# Altium project planespotter.PrjPCB
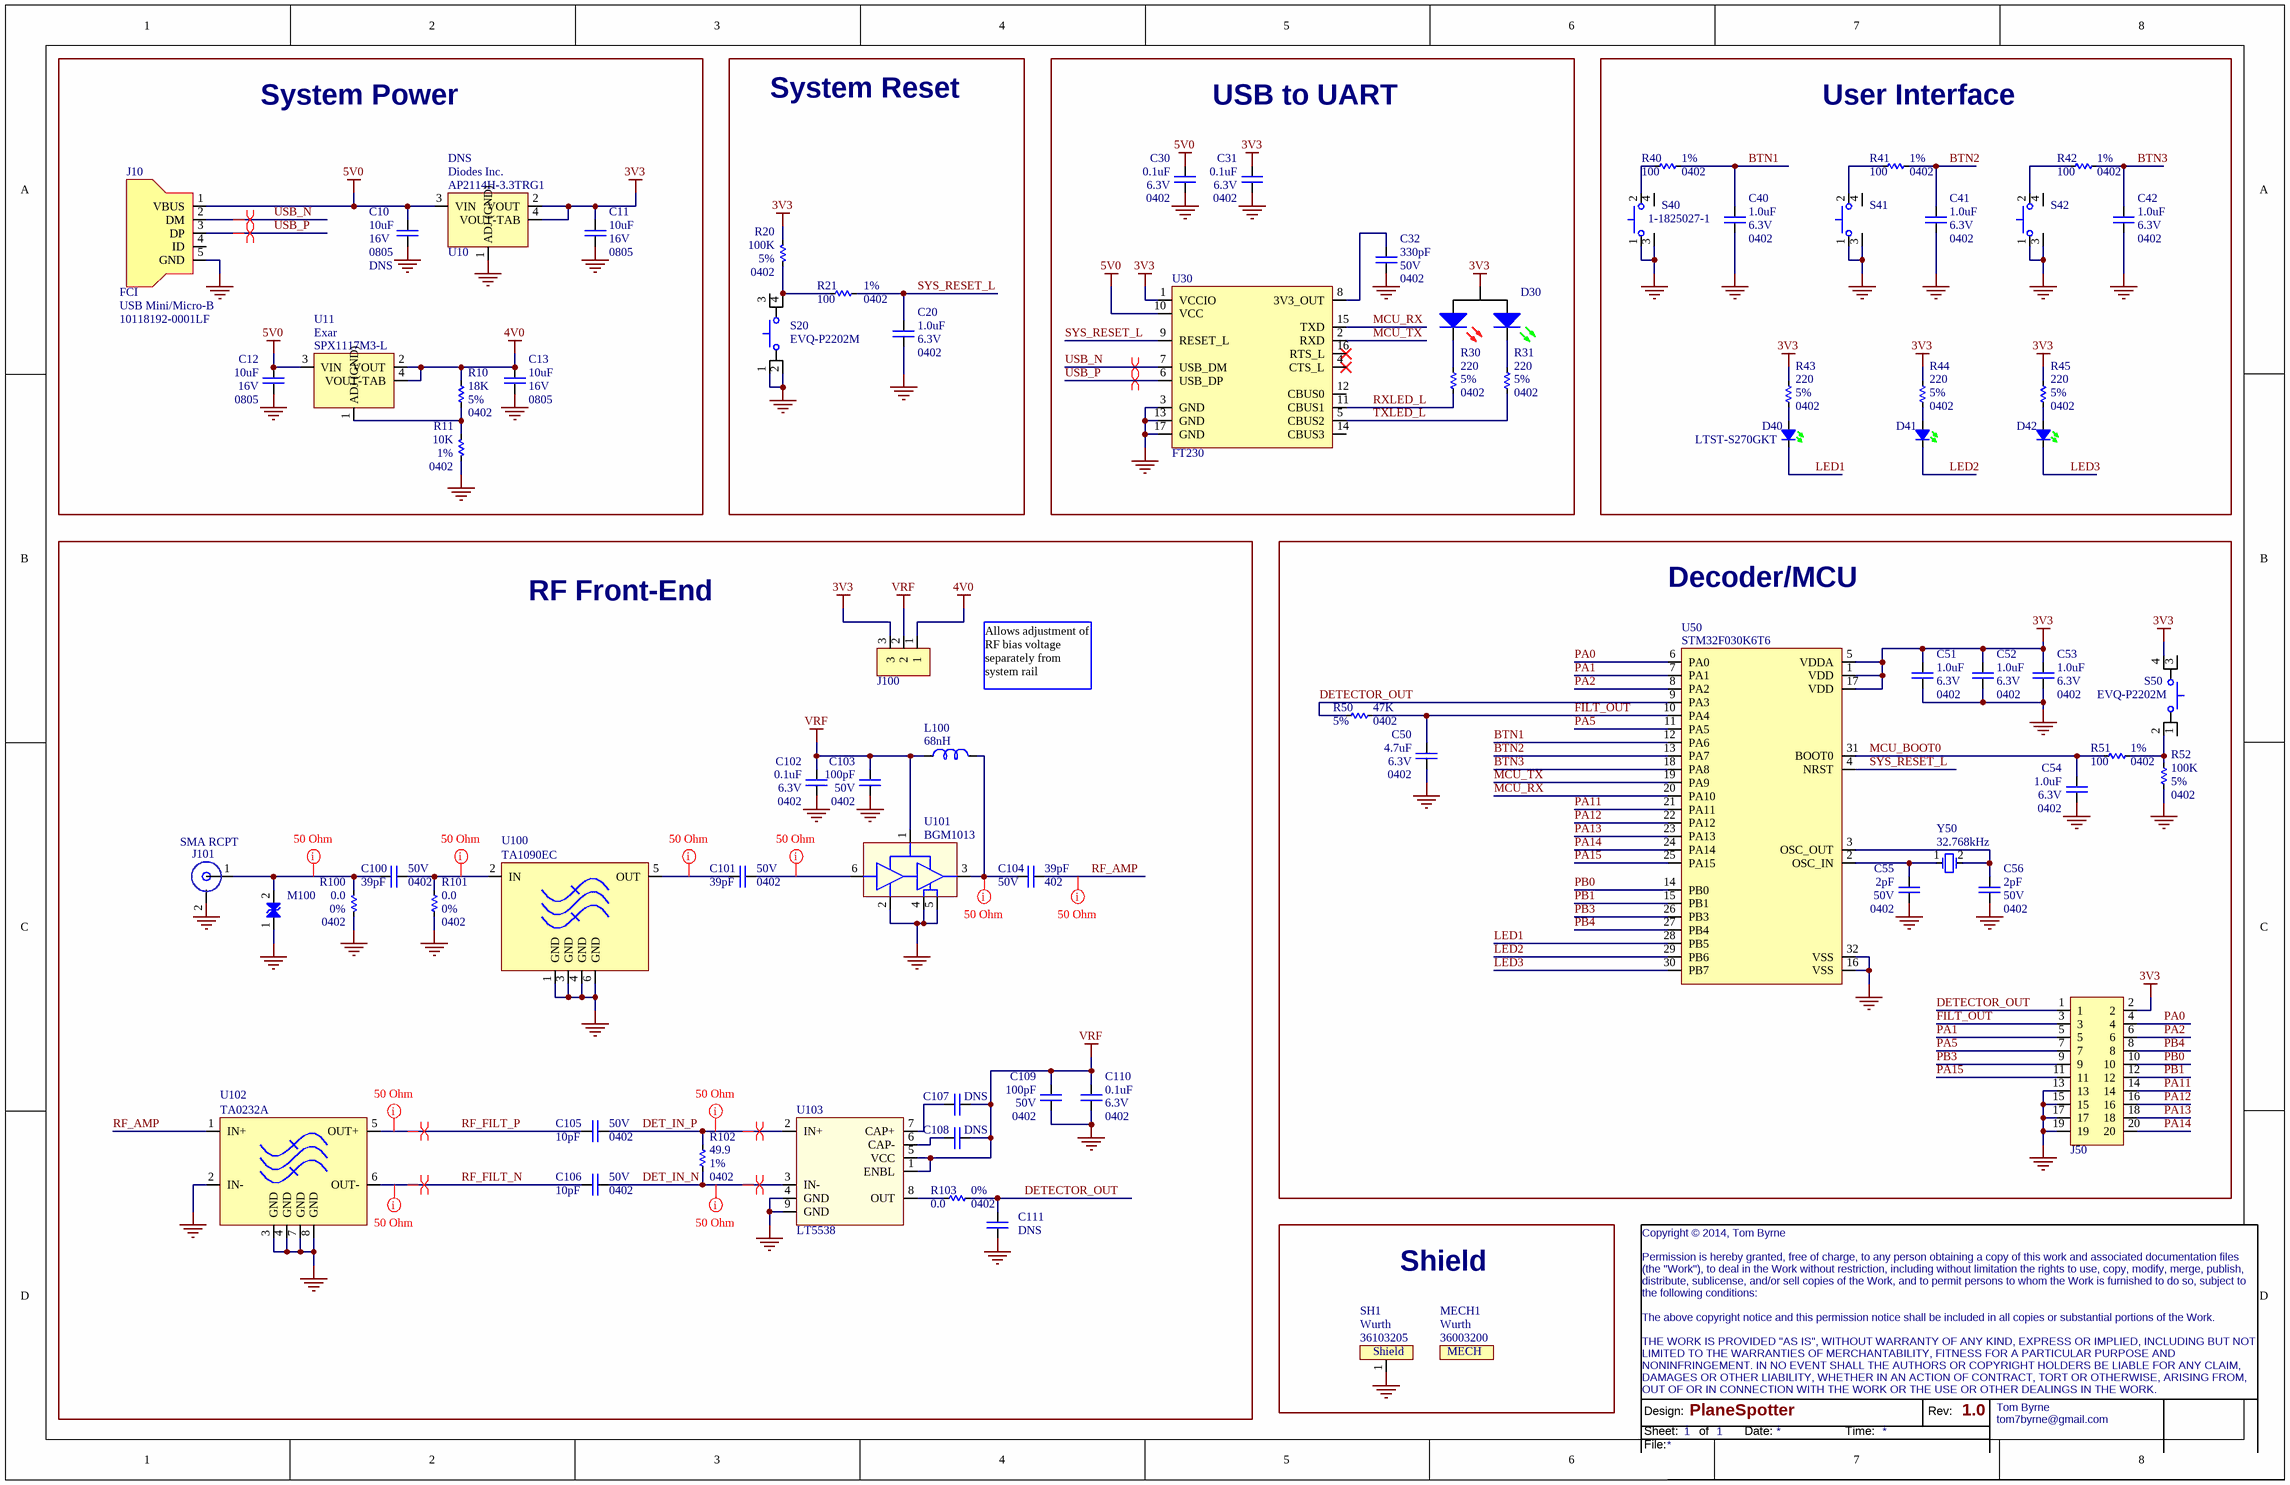
[diagram p0: planespotter.SchDoc]
1 sheet, 75 parts. Net scope: global (net labels, ports and power ports of the same name join across sheets).
Board file: planespotter.PcbDoc

## Sheet planespotter.SchDoc: PlaneSpotter
size Tabloid; Revision: 1.0; SheetNumber: 1; SheetTotal: 1; ProjectName: PlaneSpotter

### Parts
C10  value 10uF  Voltage: 16V  Package: 0805  BOMOPTION: DNS  [CAPC2012X14N]  (hidden comment: Ceramic Capacitor)  (no BOM)
C11  value 10uF  Voltage: 16V  Package: 0805  [CAPC2012X14N]  (hidden comment: Ceramic Capacitor)
C12  value 10uF  Voltage: 16V  Package: 0805  [CAPC2012X14N]  (hidden comment: Ceramic Capacitor)
C13  value 10uF  Voltage: 16V  Package: 0805  [CAPC2012X14N]  (hidden comment: Ceramic Capacitor)
C20  value 1.0uF  Voltage: 6.3V  Package: 0402  [CAPC1005X07N]  (hidden comment: Ceramic Capacitor)
C30  value 0.1uF  Voltage: 6.3V  Package: 0402  [CAPC1005X07N]  (hidden comment: Ceramic Capacitor)
C31  value 0.1uF  Voltage: 6.3V  Package: 0402  [CAPC1005X07N]  (hidden comment: Ceramic Capacitor)
C32  value 330pF  Voltage: 50V  Package: 0402  [CAPC1005X07N]  (hidden comment: Ceramic Capacitor)
C40  value 1.0uF  Voltage: 6.3V  Package: 0402  [CAPC1005X07N]  (hidden comment: Ceramic Capacitor)
C41  value 1.0uF  Voltage: 6.3V  Package: 0402  [CAPC1005X07N]  (hidden comment: Ceramic Capacitor)
C42  value 1.0uF  Voltage: 6.3V  Package: 0402  [CAPC1005X07N]  (hidden comment: Ceramic Capacitor)
C50  value 4.7uF  Voltage: 6.3V  Package: 0402  [CAPC1005X07N]  (hidden comment: Ceramic Capacitor)
C51  value 1.0uF  Voltage: 6.3V  Package: 0402  [CAPC1005X07N]  (hidden comment: Ceramic Capacitor)
C52  value 1.0uF  Voltage: 6.3V  Package: 0402  [CAPC1005X07N]  (hidden comment: Ceramic Capacitor)
C53  value 1.0uF  Voltage: 6.3V  Package: 0402  [CAPC1005X07N]  (hidden comment: Ceramic Capacitor)
C54  value 1.0uF  Voltage: 6.3V  Package: 0402  [CAPC1005X07N]  (hidden comment: Ceramic Capacitor)
C55  value 2pF  Voltage: 50V  Package: 0402  [CAPC1005X07N]  (hidden comment: Ceramic Capacitor)
C56  value 2pF  Voltage: 50V  Package: 0402  [CAPC1005X07N]  (hidden comment: Ceramic Capacitor)
C100  value 39pF  Voltage: 50V  Package: 0402  [CAPC1005X07N]  (hidden comment: Ceramic Capacitor)
C101  value 39pF  Voltage: 50V  Package: 0402  [CAPC1005X07N]  (hidden comment: Ceramic Capacitor)
C102  value 0.1uF  Voltage: 6.3V  Package: 0402  [CAPC1005X07N]  (hidden comment: Ceramic Capacitor)
C103  value 100pF  Voltage: 50V  Package: 0402  [CAPC1005X07N]  (hidden comment: Ceramic Capacitor)
C104  value 39pF  Voltage: 50V  Package: 402  [CAPC1005X07N]  (hidden comment: Ceramic Capacitor)
C105  value 10pF  Voltage: 50V  Package: 0402  [CAPC1005X07N]  (hidden comment: Ceramic Capacitor)
C106  value 10pF  Voltage: 50V  Package: 0402  [CAPC1005X07N]  (hidden comment: Ceramic Capacitor)
C107  BOMOPTION: DNS  [CAPC1005X07N]  (hidden comment: Ceramic Capacitor)  (no BOM)
C108  BOMOPTION: DNS  [CAPC1005X07N]  (hidden comment: Ceramic Capacitor)  (no BOM)
C109  value 100pF  Voltage: 50V  Package: 0402  [CAPC1005X07N]  (hidden comment: Ceramic Capacitor)
C110  value 0.1uF  Voltage: 6.3V  Package: 0402  [CAPC1005X07N]  (hidden comment: Ceramic Capacitor)
C111  BOMOPTION: DNS  [CAPC1005X07N]  (hidden comment: Ceramic Capacitor)  (no BOM)
D30  LED Red and Green  [XZMDKVG88W]  (value not drawn)
D40  Manufacturer Part Number: LTST-S270GKT  [LED0603X3N-RA]  (hidden comment: LED Green)
D41  LED Green  [LED0603X3N-RA]  (value not drawn)
D42  LED Green  [LED0603X3N-RA]  (value not drawn)
J10  USB Mini/Micro-B  Manufacturer: FCI  [10118192-0001LF]
J50  Header  [HDR254P2X10-N]  (value not drawn)
J100  Header  [HDR254P1X3-N]  (value not drawn)
J101  SMA RCPT  [142-0701-801]
L100  value 68nH  [INDC1005X06N]  (hidden comment: Inductor)
M100  MOV  [VAR1005X06N]  (value not drawn)
MECH1  Manufacturer: Wurth  Manufacturer Part Number: 36003200  [MECH]  (hidden comment: Mechanical)  (mechanical)
R10  value 18K  Package: 0402  Tolerance: 5%  [RESC1005X04N]  (hidden comment: Resistor)
R11  value 10K  Package: 0402  Tolerance: 1%  [RESC1005X04N]  (hidden comment: Resistor)
R20  value 100K  Package: 0402  Tolerance: 5%  [RESC1005X04N]  (hidden comment: Resistor)
R21  value 100  Package: 0402  Tolerance: 1%  [RESC1005X04N]  (hidden comment: Resistor)
R30  value 220  Package: 0402  Tolerance: 5%  [RESC1005X04N]  (hidden comment: Resistor)
R31  value 220  Package: 0402  Tolerance: 5%  [RESC1005X04N]  (hidden comment: Resistor)
R40  value 100  Package: 0402  Tolerance: 1%  [RESC1005X04N]  (hidden comment: Resistor)
R41  value 100  Package: 0402  Tolerance: 1%  [RESC1005X04N]  (hidden comment: Resistor)
R42  value 100  Package: 0402  Tolerance: 1%  [RESC1005X04N]  (hidden comment: Resistor)
R43  value 220  Package: 0402  Tolerance: 5%  [RESC1005X04N]  (hidden comment: Resistor)
R44  value 220  Package: 0402  Tolerance: 5%  [RESC1005X04N]  (hidden comment: Resistor)
R45  value 220  Package: 0402  Tolerance: 5%  [RESC1005X04N]  (hidden comment: Resistor)
R50  value 47K  Package: 0402  Tolerance: 5%  [RESC1005X04N]  (hidden comment: Resistor)
R51  value 100  Package: 0402  Tolerance: 1%  [RESC1005X04N]  (hidden comment: Resistor)
R52  value 100K  Package: 0402  Tolerance: 5%  [RESC1005X04N]  (hidden comment: Resistor)
R100  value 0.0  Package: 0402  Tolerance: 0%  [RESC1005X04N]  (hidden comment: Resistor)
R101  value 0.0  Package: 0402  Tolerance: 0%  [RESC1005X04N]  (hidden comment: Resistor)
R102  value 49.9  Package: 0402  Tolerance: 1%  [RESC1005X04N]  (hidden comment: Resistor)
R103  value 0.0  Package: 0402  Tolerance: 0%  [RESC1005X04N]  (hidden comment: Resistor)
S20  Manufacturer Part Number: EVQ-P2202M  [BTN470X350X210-4N]  (hidden comment: Push Button)
S40  Push Button  [1-1825027-1]  (value not drawn)
S41  Push Button  [1-1825027-1]  (value not drawn)
S42  Push Button  [1-1825027-1]  (value not drawn)
S50  Manufacturer Part Number: EVQ-P2202M  [BTN470X350X210-4N]  (hidden comment: Push Button)
SH1  Manufacturer: Wurth  Manufacturer Part Number: 36103205  [SHIELD_21x21x3_FRAME_SMD]  (hidden comment: Sheild)
U10  Manufacturer: Diodes Inc.  Manufacturer Part Number: AP2114H-3.3TRG1  BOMOPTION: DNS  [SOT230P700X180-4N]  (hidden comment: AP1117)  (no BOM)
U11  Manufacturer: Exar  Manufacturer Part Number: SPX1117M3-L  [SOT230P700X180-4N]  (hidden comment: AP1117)
U30  FT230  [QFN65P400X400X80_HS-17N]
U50  Manufacturer Part Number: STM32F030K6T6  [TQFP80P900X900X160-32N]  (hidden comment: STM32F0)
U100  TA1090EC  [QFN127P380X380X150-6N]
U101  BGM1013  [SOT65P210X80-6N]
U102  TA0232A  [QFN127P380X380X125-8N]
U103  LT5538  [QFN50P300X300X80_HS-9N]
Y50  Frequency: 32.768kHz  [XTAL_32X15X09-2N]  (hidden comment: XTAL_COMPACT)

### Blocks framed on the sheet
System Power: C10-C13 J10 R10 R11 U10 U11
System Reset: C20 R20 R21 S20
USB to UART: C30-C32 D30 R30 R31 U30
User Interface: C40-C42 D40-D42 R40-R45 S40-S42
RF Front-End: C100-C111 J100 J101 L100 M100 R100-R103 U100-U103
Decoder/MCU: C50-C56 J50 R50-R52 S50 U50 Y50
Shield: MECH1 SH1

### Nets
3V3: C11.2 C31.2 C51.2 C52.2 C53.2 D30.A J50.2 J100.3 R20.1 R43.1 R44.1 R45.1 S50.4 U10.2(VOUT) U10.4(VOUT-TAB) U30.1(VCCIO) U50.1(VDD) U50.5(VDDA) U50.17(VDD)
4V0: C13.2 J100.1 R10.1 U11.2(VOUT) U11.4(VOUT-TAB)
5V0: C10.2 C12.2 C30.2 J10.1(VBUS) U10.3(VIN) U11.3(VIN) U30.10(VCC)
GND: C10.1 C11.1 C12.1 C13.1 C20.1 C30.1 C31.1 C32.1 C40.1 C41.1 C42.1 C50.1 C51.1 C52.1 C53.1 C54.1 C55.1 C56.1 C102.1 C103.1 C109.1 C110.1 C111.1 J10.5(GND) J50.13 J50.15 J50.17 J50.19 J101.2(GND) M100.1(A) R11.2 R52.2 R100.2 R101.2 S20.1 S20.2 S40.1 S40.3 S41.1 S41.3 S42.1 S42.3 SH1.1 U10.1(ADJ_(GND)) U30.3(GND) U30.13(GND) U30.17(GND) U50.16(VSS) U50.32(VSS) U100.1(GND) U100.3(GND) U100.4(GND) U100.6(GND) U101.2(GND) U101.4(GND) U101.5(GND) U102.2(IN-) U102.3(GND) U102.4(GND) U102.7(GND) U102.8(GND) U103.4(GND) U103.9(GND)
VRF: C102.2 C103.2 C107.2 C108.1 C109.2 C110.2 J100.2 L100.1 U101.1(VDD) U103.1(ENBL) U103.5(VCC)
BTN1: C40.2 R40.2 U50.12(PA6)
BTN2: C41.2 R41.2 U50.13(PA7)
BTN3: C42.2 R42.2 U50.18(PA8)
DET_IN_N: C106.1 R102.2 U103.3(IN-)
DET_IN_P: C105.1 R102.1 U103.2(IN+)
DETECTOR_OUT: C111.2 J50.1 R50.1 R103.2 U50.9(PA3)
FILT_OUT: C50.2 J50.3 R50.2 U50.10(PA4)
LED1: D40.K U50.28(PB5)
LED2: D41.K U50.29(PB6)
LED3: D42.K U50.30(PB7)
MCU_BOOT0: C54.2 R51.1 U50.31(BOOT0)
MCU_RX: U30.15(TXD) U50.20(PA10)
MCU_TX: U30.2(RXD) U50.19(PA9)
PA0: J50.4 U50.6(PA0)
PA1: J50.5 U50.7(PA1)
PA2: J50.6 U50.8(PA2)
PA5: J50.7 U50.11(PA5)
PA11: J50.14 U50.21(PA11)
PA12: J50.16 U50.22(PA12)
PA13: J50.18 U50.23(PA13)
PA14: J50.20 U50.24(PA14)
PA15: J50.11 U50.25(PA15)
PB0: J50.10 U50.14(PB0)
PB1: J50.12 U50.15(PB1)
PB3: J50.9 U50.26(PB3)
PB4: J50.8 U50.27(PB4)
RF_AMP: C104.1 U102.1(IN+)
RF_FILT_N: C106.2 U102.6(OUT-)
RF_FILT_P: C105.2 U102.5(OUT+)
RXLED_L: R30.2 U30.11(CBUS1)
SYS_RESET_L: C20.2 R21.2 U30.9(RESET_L) U50.4(NRST)
TXLED_L: R31.2 U30.5(CBUS2)
USB_N: J10.2(DM) U30.7(USB_DM)
USB_P: J10.3(DP) U30.6(USB_DP)
NetC32_2: C32.2 U30.8(3V3_OUT)
NetC55_2: C55.2 U50.2(OSC_IN) Y50.1(OSC1)
NetC56_2: C56.2 U50.3(OSC_OUT) Y50.2(OSC2)
NetC100_1: C100.1 R101.1 U100.2(IN)
NetC100_2: C100.2 J101.1(SHLD) M100.2(K) R100.1
NetC101_1: C101.1 U101.6(RF_IN)
NetC101_2: C101.2 U100.5(OUT)
NetC104_2: C104.2 L100.2 U101.3(RF_OUT)
NetC107_1: C107.1 U103.7(CAP+)
NetC108_2: C108.2 U103.6(CAP-)
NetD30_KG: D30.KG R31.1
NetD30_KR: D30.KR R30.1
NetD40_A: D40.A R43.2
NetD41_A: D41.A R44.2
NetD42_A: D42.A R45.2
NetR10_2: R10.2 R11.1 U11.1(ADJ_(GND))
NetR20_2: R20.2 R21.1 S20.4
NetR40_1: R40.1 S40.2
NetR41_1: R41.1 S41.2
NetR42_1: R42.1 S42.2
NetR51_2: R51.2 R52.1 S50.2
NetR103_1: R103.1 U103.8(OUT)

Not connected (* = marked no-connect by the designer): J10 4(ID); S20 3; S40 4; S41 4; S42 4; S50 1 3; U30 4(CTS_L)* 12(CBUS0) 14(CBUS3) 16(RTS_L)*

### Layout directives
differential pair: DET_IN_N, DET_IN_P, RF_FILT_N, RF_FILT_P, USB_N, USB_P
net class 50_OHM: DET_IN_N, DET_IN_P, NetC100_1, NetC100_2, NetC101_1, NetC101_2, NetC104_2, RF_AMP, RF_FILT_N, RF_FILT_P

### Notes on the sheet
- Allows adjustment of RF bias voltage separately from system rail
- Copyright © 2014, Tom Byrne
  Permission is hereby granted, free of charge, to any person obtaining a copy of this work and associated documentation files (the "Work"), to deal in the Work without restriction, including without limitation the rights to use, copy, modify, merge, publish, distribute, sublicense, and/or sell copies of the Work, and to permit persons to whom the Work is furnished to do so, subject to the following conditions:
  The above copyright notice and this permission notice shall be included in all copies or substantial portions of the Work.
  THE WORK IS PROVIDED "AS IS", WITHOUT WARRANTY OF ANY KIND, EXPRESS OR IMPLIED, INCLUDING BUT NOT LIMITED TO THE WARRANTIES OF MERCHANTABILITY, FITNESS FOR A PARTICULAR PURPOSE AND NONINFRINGEMENT. IN NO EVENT SHALL THE AUTHORS OR COPYRIGHT HOLDERS BE LIABLE FOR ANY CLAIM, DAMAGES OR OTHER LIABILITY, WHETHER IN AN ACTION OF CONTRACT, TORT OR OTHERWISE, ARISING FROM, OUT OF OR IN CONNECTION WITH THE WORK OR THE USE OR OTHER DEALINGS IN THE WORK.
- Design:
- Sheet:
- of
- Date:
- Time:
- Rev:
- Tom Byrne
- tom7byrne@gmail.com
- File:
- (in symbol SHD00001) Shield

### Library data of the parts
C10 C11 = CAPC00037: CAP,X5R,10uF,10%,16V,0805,#; Manufacturer: Taiyo Yuden; Manufacturer Part Number: EMK212BJ106KG-T; Tolerance: 10%; Dielectric: X5R; Part Number: CAPC00037; Manufacturer 2: TDK; Manufacturer Part Number 2: C2012X5R1C106K/0.85; Supplier 1: Digi-Key; Supplier Part Number 1: 587-1295-1-ND; Supplier Price 1: 0.05355; Supplier 2: Digi-Key; Supplier Part Number 2: 445-7644-1-ND; Supplier Price 2: 0.06345
C12 C13 = CAPC00037: CAP,X5R,10uF,10%,16V,0805,#; Manufacturer: Samsung; Manufacturer Part Number: CL21A106KOQNNNE; Tolerance: 10%; Dielectric: X5R; Part Number: CAPC00037; Manufacturer 2: Taiyo Yuden; Manufacturer Part Number 2: EMK212BJ106KG-T; Supplier 1: Digi-Key; Supplier Part Number 1: 1276-1096-1-ND; Supplier Price 1: 0.0385; Supplier 2: Digi-Key; Supplier Part Number 2: 587-1295-1-ND; Supplier Price 2: 0.05355; Stock Quantity: 1000; Stock Date: 3/12/2013
C20 C40-C42 C51-C54 = CAPC00005: CAP,X5R,1.0uF,10%,6.3V, 0402,#; Manufacturer: Murata; Manufacturer Part Number: GRM155R60J105KE19D; Tolerance: 10%; Dielectric: X5R; Part Number: CAPC00005; Manufacturer 2: Samsung; Manufacturer Part Number 2: CL05A105KQ5NNNC; Supplier 1: Digi-Key; Supplier Part Number 1: 490-1320-1-ND; Supplier Price 1: 0.0087; Supplier 2: Digi-Key; Supplier Part Number 2: 1276-1010-1-ND; Supplier Price 2: 0.009; Stock Quantity: 1000; Stock Date: 3/12/2013
C30 C31 C102 C107 C108 C110 C111 = CAPC00002: CAP,X5R,0.1uF,10%,6.3V, 0402,#; Manufacturer: TDK; Manufacturer Part Number: C1005X5R0J104K; Tolerance: 10%; Dielectric: X5R; Part Number: CAPC00002; Manufacturer 2: Murata; Manufacturer Part Number 2: GRM155R60J104KA01D; Supplier 1: Digi-Key; Supplier Part Number 1: 445-1266-1-ND; Supplier Price 1: 0.0066; Supplier 2: Mouser; Supplier Part Number 2: 81-GRM155R60J104KA1D; Supplier Price 2: 0.007; Stock Quantity: 300; Stock Date: 4/19/2013
  C107 C108 C111: Value: 0.1uF; Voltage: 6.3V; Package: 0402
C32 = CAPC00048: CAP,C0G,330pF,5%,50V,0402; Manufacturer: Taiyo Yuden; Manufacturer Part Number: UMK105CG331JV-F; Tolerance: 5%; Dielectric: C0G; Part Number: CAPC00048; Manufacturer 2: TDK; Manufacturer Part Number 2: C1005C0G1H331J; Supplier 1: Digi-Key; Supplier Part Number 1: 587-1217-1-ND; Supplier Price 1: 0.0078; Supplier 2: Digi-Key; Supplier Part Number 2: 445-1253-1-ND; Supplier Price 2: 0.0096
C50 = CAPC00097: CAP,X5R,4.7uF,20%,6.3V, 0402; Manufacturer: Samsung; Manufacturer Part Number: CL05A475MQ5NRNC; Tolerance: 20%; Dielectric: X5R; Part Number: CAPC00097; Manufacturer 2: Taiyo Yuden; Manufacturer Part Number 2: JMK105BBJ475MV-F; Supplier 1: Digi-Key; Supplier Part Number 1: 1276-1056-1-ND; Supplier Price 1: 0.04922; Supplier 2: Digi-Key; Supplier Part Number 2: 587-2787-1-ND; Supplier Price 2: 0.0846
C55 C56 = CAPC00100: CAP,C0G,2pF,±0.25pF,50V,0402; Manufacturer: Samsung; Manufacturer Part Number: CL05C020CB5NNNC; Tolerance: 0.25pF; Dielectric: C0G; Part Number: CAPC00100; Supplier 1: Digi-Key; Supplier Part Number 1: 1276-1270-1-ND; Supplier Price 1: 0.00525
C100 C101 C104 = CAP00012: CAP,39pF,50V,5%,NP0,0402; Manufacturer: Samsung; Manufacturer Part Number: CL05C390JB5NNNC; Tolerance: 5%; Dielectric: NP0; Part Number: CAP00012; Supplier 1: Digi-Key; Supplier Part Number 1: 1276-1016-1-ND; Supplier Price 1: 0.00351
C103 C109 = CAPC00043: CAP,C0G,100pF,5%,50V,0402; Manufacturer: Yageo; Manufacturer Part Number: CC0402JRNPO9BN101; Tolerance: 5%; Dielectric: C0G; Part Number: CAPC00043; Manufacturer 2: Samsung; Manufacturer Part Number 2: CL05C101JB5NNNC; Supplier 1: Digi-Key; Supplier Part Number 1: 311-1024-1-ND; Supplier Price 1: 0.00324; Supplier 2: Digi-Key; Supplier Part Number 2: 1276-1025-1-ND; Supplier Price 2: 0.00324; Stock Quantity: 500; Stock Date: 3/12/2013
C105 C106 = CAPC00008: CAP,C0G,10pF,+/-0.25pF,50V, 0402; Manufacturer: Samsung; Manufacturer Part Number: CL05C100CB5NCNC; Tolerance: 0.25pF; Dielectric: C0G; Part Number: CAPC00008; Manufacturer 2: TDK; Manufacturer Part Number 2: C1005C0G1H100CT; Supplier 1: Digi-Key; Supplier Part Number 1: 1276-1622-1-ND; Supplier Price 1: 0.00432; Supplier 2: Mouser; Supplier Part Number 2: 810-C1005C0G1H100C; Supplier Price 2: 0.007; Stock Quantity: 8; Stock Date: 3/12/2013
D30 = LED00009: LED, Red and Green, Side-view, Common Anode, 1.95/2.1V, 630/570nm, 120/40mcd, SMT; Manufacturer: SunLED; Color: Red/Green; Millicandela Rating (min): 120mcd, 40mcd; Voltage - Forward (Vf) Typ: 1.95V, 2.1V; Current - Test: 20mA; Wavelength - Dominant: 630nm, 570nm; Wavelength - Peak: 650nm, 574nm; Viewing Angle: 120°; Lens Type: Clear; Part Number: LED00009; Package: SMT; Orientation: Side-view; Manufacturer Part Number: XZMDKVG88W; Stock Quantity: 0; Stock Date: 4/1/2013; ComponentLink1URL: http://www.sunledusa.com/products/spec/XZMDKVG88W.pdf
D40 = LED00051: LED, Green, 2.1V, 569nm, 10mcd, 0603 Side-View; Manufacturer: Liteon; Current - Test: 20mA; Wavelength - Peak: 565nm; Viewing Angle: 130º; Lens Type: Clear; Part Number: LED00051; Package: 0603; Orientation: Side-view; Color: Green; Millicandela Rating (min): 10mcd; Voltage - Forward (Vf) Typ: 2.1V; Wavelength - Dominant: 569nm; Supplier 1: Digi-Key; Supplier Part Number 1: 160-1475-1-ND; Supplier Price 1: 0.05616; ComponentLink1URL: http://www.digikey.com/product-detail/en/LTST-S270GKT/160-1475-1-ND/386886
D41 D42 = LED00051: LED, Green, 2.1V, 569nm, 10mcd, 0603 Side-View; Manufacturer: Liteon; Manufacturer Part Number: LTST-S270GKT; Current - Test: 20mA; Wavelength - Peak: 565nm; Viewing Angle: 130º; Lens Type: Clear; Part Number: LED00051; Package: 0603; Orientation: Side-view; Color: Green; Millicandela Rating (min): 10mcd; Voltage - Forward (Vf) Typ: 2.1V; Wavelength - Dominant: 569nm; Supplier 1: Digi-Key; Supplier Part Number 1: 160-1475-1-ND; Supplier Price 1: 0.05616; ComponentLink1URL: http://www.digikey.com/product-detail/en/LTST-S270GKT/160-1475-1-ND/386886
J10 = USB00005: Conn, USB, RCPT, Type B, Micro, Surface Mount; Part Number: USB00005; Manufacturer Part Number: 10118192-0001LF; Supplier 1: Digi-Key; Supplier Part Number 1: 609-4613-1-ND; Supplier Price 1: 0.25988; ComponentLink1URL: http://www.digikey.com/product-detail/en/10118192-0001LF/609-4613-1-ND/2785378
J50 = HDR00050: HDR, 2x10 Pin, 2.54mm Pitch, TH; Manufacturer: FCI; Manufacturer Part Number: 67996-420HLF; Gender: Male; Connector Type: Unshrouded; Number of Columns: 10; Number of Positions Loaded: 20; Part Number: HDR00050; Number of Rows: 2; Pitch: 2.54mm; Mounting Type: Through Hole; Orientation: Vertical; Contact Finish: Tin; Supplier 1: Digi-Key; Supplier Part Number 1: 609-3221-ND; Supplier Price 1: 0.3404
J100 = HDR00003: HDR, 1x3 Pin, 2.54mm Pitch, Gold Flash, Vertical, TH; Manufacturer: FCI; Manufacturer Part Number: 68000-403HLF; Gender: Male; Connector Type: Unshrouded; Number of Columns: 3; Part Number: HDR00003; Number of Rows: 1; Number of Positions Loaded: 3; Pitch: 2.54mm; Mounting Type: Through Hole; Orientation: Vertical; Contact Finish: Gold Flash; Manufacturer 2: 4UCON; Manufacturer Part Number 2: 00798; Supplier 1: Digi-Key; Supplier Part Number 1: 609-3504-ND; Supplier Price 1: 0.92805; Supplier 2: 4UCON; Supplier Part Number 2: 00798; Supplier Price 2: 0.0069
J101 = CON00037: CONN SMA JACK 50 OHM EDGE MNT; Manufacturer: Emerson NPC Johnson; Part Number: CON00037; Manufacturer Part Number: 142-0701-801; Supplier 1: Digi-Key; Supplier Part Number 1: J502-ND; Supplier Price 1: 2.3125; ComponentLink1URL: http://www.digikey.com/product-detail/en/142-0701-801/J502-ND/35280
L100 = IND00001: Chip Inductor, 68 nH, 180 mA, 1.2Ω, 0402; Manufacturer: Pulse; Manufacturer Part Number: PE-0402CC680JTT; Current: 180mA; Tolerance: ±5%; Part Number: IND00001; Package: 0402; Current - Saturation: -; Current - Temperature Rise: -; DC Resistance (DCR): 1.2Ω; Supplier 1: Digi-Key; Supplier Price 1: 0.0114; ComponentLink1URL: http://www.digikey.com/product-detail/en/PE-0402CC680JTT/553-2339-1-ND/5014473
M100 = TVS00006: Varistor,10V,10A,0402; Manufacturer: Yageo; Manufacturer Part Number: VRS0402SR55R100N; Max VDC: 5.5V; Part Number: TVS00006; Varistor Voltage: 10V; Imax: 10A; Supplier 1: Digi-Key; Supplier Part Number 1: 311-1515-1-ND; Supplier Price 1: 0.00529; ComponentLink1URL: http://www.digikey.com/product-detail/en/VRS0402SR55R100N/311-1515-1-ND/2833821
MECH1 = SHD00002: RF Shield, Cover, 20mm x 20mm x 3mm; Part Number: SHD00002; Supplier 1: Digi-Key; Supplier Part Number 1: 732-2488-ND; Supplier Price 1: 2.8875; ComponentLink1URL: http://www.digikey.com/product-detail/en/36003200/732-2488-ND/2337463
R10 = RES00050: RES,18K,5%,0.063W,0402; Manufacturer: Samsung; Manufacturer Part Number: RC1005J183CS; Part Number: RES00050; Power: 0.063W; Manufacturer 2: Yageo; Manufacturer Part Number 2: RC0402JR-0718KL; Supplier 1: Digi-Key; Supplier Part Number 1: 1276-4406-1-ND; Supplier Price 1: 0.0023; Supplier 2: Digi-Key; Supplier Part Number 2: 311-18KJRCT-ND; Supplier Price 2: 0.00237
R11 = RES00020: RES,10K,1%,0.063W,0402,#; Manufacturer: Yageo; Manufacturer Part Number: RC0402FR-0710KL; Part Number: RES00020; Power: 0.063W; Manufacturer 2: ROHM; Manufacturer Part Number 2: MCR01MRTF1002; Supplier 1: Digi-Key; Supplier Part Number 1: 311-10.0KLRCT-ND; Supplier Price 1: 0.0027; Supplier 2: Digi-Key; Supplier Part Number 2: RHM10.0KCDCT-ND; Supplier Price 2: 0.0048
R20 R52 = RES00001: RES,100K,5%,0.063W,0402,#; Manufacturer: Samsung; Manufacturer Part Number: RC1005J104CS; Part Number: RES00001; Power: 0.063W; Manufacturer 2: ROHM; Manufacturer Part Number 2: MCR01MRTJ104; Supplier 1: Digi-Key; Supplier Part Number 1: 1276-4424-1-ND; Supplier Price 1: 0.0023; Supplier 2: Digi-Key; Supplier Part Number 2: HM100KCECT-ND; Supplier Price 2: 0.00233; Stock Quantity: 2100; Stock Date: 4/5/2013
R21 R40-R42 R51 = RES00024: RES,100 Ohm,1%,0.063W,0402,#; Manufacturer: Yageo; Manufacturer Part Number: RC0402FR-07100RL; Part Number: RES00024; Power: 0.063W; Manufacturer 2: ROHM; Manufacturer Part Number 2: MCR01MRTF1000; Supplier 1: Digi-Key; Supplier Part Number 1: 311-100LRCT-ND; Supplier Price 1: 0.0027; Supplier 2: Digi-Key; Supplier Part Number 2: RHM100CDCT-ND; Supplier Price 2: 0.0048; Stock Quantity: 1000; Stock Date: 4/5/2013
R30 R31 R43-R45 = RES00011: RES,220 Ohm,5%,0.063W,0402; Manufacturer: Yageo; Manufacturer Part Number: RC0402JR-07220RL; Part Number: RES00011; Power: 0.063W; Manufacturer 2: Panasonic; Manufacturer Part Number 2: ERJ-2GEJ221X; Supplier 1: Digi-Key; Supplier Part Number 1: 311-220JRCT-ND; Supplier Price 1: 0.00237; Supplier 2: Digi-Key; Supplier Part Number 2: P220JCT-ND; Supplier Price 2: 0.0048
R50 = RES00008: RES,47K,5%,0.063W,0402; Manufacturer: Yageo; Manufacturer Part Number: RC0402JR-0747KL; Part Number: RES00008; Power: 0.063W; Manufacturer 2: ROHM; Manufacturer Part Number 2: MCR01MRTJ473; Supplier 1: Digi-Key; Supplier Part Number 1: 311-47KJRCT-ND; Supplier Price 1: 0.00237; Supplier 2: Digi-Key; Supplier Part Number 2: RHM47KCECT-ND; Supplier Price 2: 0.00352
R100 R101 R103 = RES00019: RES,0 Ohm,0.063W,0402; Manufacturer: Yageo; Manufacturer Part Number: RC0402JR-070RL; Part Number: RES00019; Power: 0.063W; Manufacturer 2: ROHM; Manufacturer Part Number 2: MCR01MRTJ000; Supplier 1: Digi-Key; Supplier Part Number 1: 311-0.0JRCT-ND; Supplier Price 1: 0.00237; Supplier 2: Digi-Key; Supplier Part Number 2: RHM0.0CECT-ND; Supplier Price 2: 0.00352
R102 = RES00104: RES,49.9 Ohm,1%,0.063W,0402; Manufacturer: Rohm; Manufacturer Part Number: MCR03ERTF49R9; Power: 0.1W; Part Number: RES00104; Manufacturer 2: Samsung; Manufacturer Part Number 2: RC1608F49R9CS; Supplier 1: Digi-Key; Supplier Part Number 1: RHM49.9CFCT-ND; Supplier Price 1: 0.0021; Supplier 2: Digi-Key; Supplier Part Number 2: 1276-3505-1-ND; Supplier Price 2: 0.0021
S20 S50 = BTN00002: SPST- NO Momentary Button, 160g Force; Manufacturer: Panasonic; Part Number: BTN00002; Supplier 1: Digi-Key; Supplier Part Number 1: P12298SCT-ND; Supplier Price 1: 0.45619; ComponentLink1URL: http://www.digikey.com/product-detail/en/EVQ-P2202M/P12298SCT-ND/593598
S40-S42 = BTN00002: Button, SPST, Off-Momentary, Normally Open, 24V, 50mA, Round, 7mm; Manufacturer: TE Connectivity; Part Number: BTN00002; Manufacturer Part Number: 1-1825027-1; Supplier 1: Digi-Key; Supplier Part Number 1: 450-1658-ND; Supplier Price 1: 0.13703; ComponentLink1URL: http://www.digikey.com/product-detail/en/1-1825027-1/450-1658-ND/1632544
SH1 = SHD00001: RF Shield, Frame, 20mm x 20mm x 3mm, SMD; Part Number: SHD00001; Supplier 1: Digi-Key; Supplier Part Number 1: 732-2486-ND; Supplier Price 1: 2.8875; ComponentLink1URL: http://www.digikey.com/product-detail/en/36103205/732-2486-ND/2337461
U10 = IC00159: IC, LDO, Fixed 3.3V, 1A, 6VIN Max, Ceramic Stable, SOT-223; Part Number: IC00159; Supplier 1: Digi-Key; Supplier Part Number 1: AP2114H-3.3TRG1DICT-ND; Supplier Price 1: 0.1305; ComponentLink1URL: http://www.digikey.com/product-detail/en/AP2114H-3.3TRG1/AP2114H-3.3TRG1DICT-ND/4505142
U11 = IC00191: IC, LDO, Adjustable 2.6V-15V Out, 1.25V-15V In, 1A Max, Ceramic Stable, SOT-223; Part Number: IC00191; Supplier 1: Digi-Key; Supplier Part Number 1: 1016-1235-5-ND; Supplier Price 1: 0.12; ComponentLink1URL: http://www.digikey.com/product-detail/en/SPX1117M3-L/1016-1235-5-ND/2411167
U30 = IC00004: USB Serial Translator, Basic, 16QFN; Manufacturer: FTDI; Manufacturer Part Number: FT230XQ-R; Part Number: IC00004; Supplier 1: Digi-Key; Supplier Part Number 1: 768-1130-1-ND; Supplier Price 1: 1.46001; ComponentLink1URL: http://www.digikey.com/product-detail/en/FT230XQ-R/768-1130-1-ND/3029158; Datasheet: http://www.ftdichip.com/Support/Documents/DataSheets/ICs/DS_FT230X.pdf
U50 = IC00001: MCU, ARM M0, 32K Flash, 32LQFP; Manufacturer: STMicro; Part Number: IC00001; Supplier 1: Digi-Key; Supplier Part Number 1: 497-14046-ND; Supplier Price 1: 0.726; ComponentLink1URL: http://www.digikey.com/product-search/en?vendor=0&keywords=STM32F030K6T6; Datasheet: http://www.st.com/web/en/resource/technical/document/datasheet/DM00088500.pdf
U100 = FILT00002: Filter, SAW, 1090 MHz, 30 MHz BW; Manufacturer: Tai-Saw; Bandwidth: 30 MHz; Manufacturer Part Number: TA1090EC; Part Number: FILT00002; Type: SAW; Center Frequency: 1090 MHz; Corner Frequency: -; Power: -
U101 = IC00003: RF Amplifier, 0-2.2GHz, 35.5dB, 6-TSSOP; Manufacturer: NXP; Manufacturer Part Number: BGM1013,115; Part Number: IC00003; Supplier 1: Digi-Key; Supplier Part Number 1: 568-2076-1-ND; Supplier 2: Mouser; Supplier Part Number 2: 771-BGM1013-T/R; Supplier Price 2: 0.162; ComponentLink1URL: http://www.mouser.com/ProductDetail/NXP-Semiconductors/BGM1013115/?qs=me8TqzrmIYXduItK%2FQyKuQ%3D%3D; Datasheet: http://www.nxp.com/documents/data_sheet/BGM1013.pdf
U102 = FILT00001: Filter, SAW, 1090 MHz, 30 MHz BW; Manufacturer: Tai-Saw; Bandwidth: 30 MHz; Manufacturer Part Number: TA0232A; Part Number: FILT00001; Type: SAW; Center Frequency: 1090 MHz; Corner Frequency: -; Power: -
U103 = IC00003: RF Log Power Detector, 40 MHz-3.8GHz, -75dBm - 10dBm, 3-5.25V, 8WFDFN; Manufacturer: Linear; Manufacturer Part Number: LT5538IDD#PBF; Part Number: IC00003; Supplier 1: Digi-Key; Supplier Part Number 1: LT5538IDD#PBF-ND; Supplier Price 1: 5.31; ComponentLink1URL: http://www.digikey.com/product-detail/en/LT5538IDD%23PBF/LT5538IDD%23PBF-ND/1931120; Datasheet: http://cds.linear.com/docs/en/datasheet/5538f.pdf
Y50 = XTAL00004: XTAL, 32.768kHz, 20ppm, 6pF, 60K Ohm, 3215; Manufacturer: Abracon; Manufacturer Part Number: ABS07-120-32.768KHZ-T; Operating Mode: Fundamental; Part Number: XTAL00004; Package: 2-SMD; Frequency Tolerance: 20ppm; Load Capacitance: 6pF; Supplier 1: Digi-Key; Supplier Part Number 1: 535-11937-1-ND; Supplier Price 1: 0.42502; Stock Quantity: 48; Stock Date: 4/1/2013; ComponentLink1URL: http://www.digikey.com/product-detail/en/ABS07-120-32.768KHZ-T/535-11937-1-ND/3724046